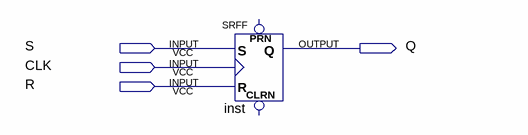
[diagram p0: schematic sheet]
// Quartus schematic RSflipflapTest.bdf as structural Verilog: 1 symbols, 4 pins
module RSflipflapTest (
  input  S,
  input  CLK,
  input  R,
  output Q
);

  SRFF inst (.S(S), .R(R), .CLK(CLK), .Q(Q));  // open: PRN, CLRN
endmodule
